# EAGLE design MotorController V2 (EAGLE 9.2.0)
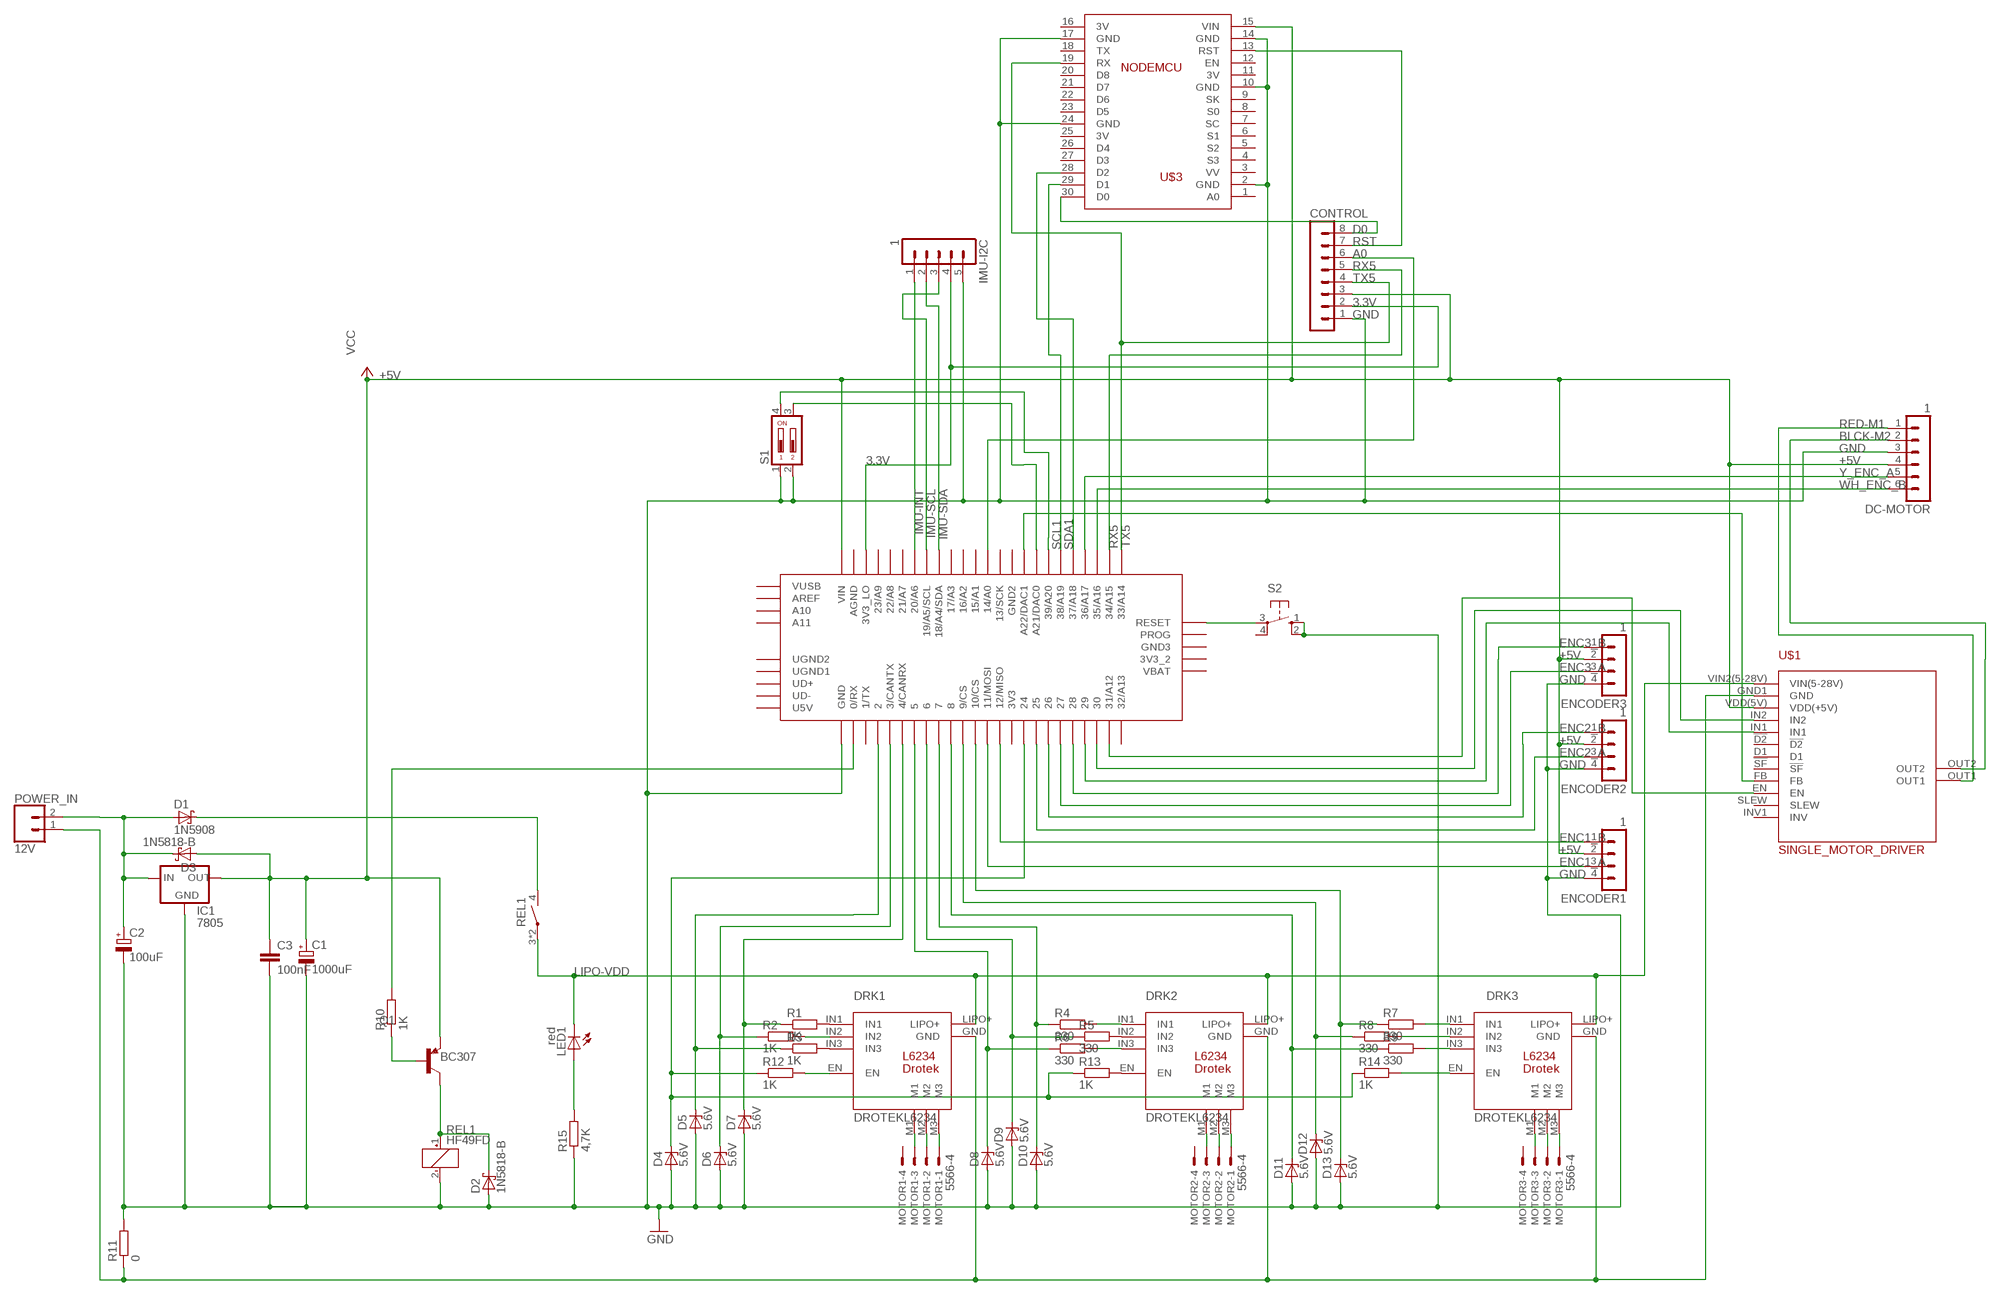
[diagram p0: schematic, sheet 1]

## Parts
C1  1000uF  CPOL-EUE2.5-6  [E2,5-6]
C2  100uF  CPOL-EUE5-5  [E5-5]
C3  100nF  C2.5/2  [C2.5-2]
CONTROL  MA08-1  [MA08-1]
D1  1N5908  [C4111-15]
D2  1N5818-B  [DO41-7.6]
D3  1N5818-B  [DO41-7.6]
D4  5.6V  ZENER-DIODEDO41Z10  [DO41Z10]
D5  5.6V  ZENER-DIODEDO41Z10  [DO41Z10]
D6  5.6V  ZENER-DIODEDO41Z10  [DO41Z10]
D7  5.6V  ZENER-DIODEDO41Z10  [DO41Z10]
D8  5.6V  ZENER-DIODEDO41Z10  [DO41Z10]
D9  5.6V  ZENER-DIODEDO41Z10  [DO41Z10]
D10  5.6V  ZENER-DIODEDO41Z10  [DO41Z10]
D11  5.6V  ZENER-DIODEDO41Z10  [DO41Z10]
D12  5.6V  ZENER-DIODEDO41Z10  [DO41Z10]
D13  5.6V  ZENER-DIODEDO41Z10  [DO41Z10]
DC-MOTOR  1  MA06-1  [MA06-1]
DRK1  DROTEKL6234  [DROTEKL6234]
DRK2  DROTEKL6234  [DROTEKL6234]
DRK3  DROTEKL6234  [DROTEKL6234]
ENCODER1  1  MA04-1  [MA04-1]
ENCODER2  1  MA04-1  [MA04-1]
ENCODER3  1  MA04-1  [MA04-1]
IC1  7805  78XXS  [78XXS]
IMU-I2C  1  MA05-1  [MA05-1]
LED1  red  LED3MM  [LED3MM]
MOTOR1  5566-4  [5566-4]
MOTOR2  5566-4  [5566-4]
MOTOR3  5566-4  [5566-4]
POWER_IN  12V  CONN_023.5MM  [SCREWTERMINAL-3.5MM-2]
PRJ1  TEENSY_3.5/3.6  [TEENSY_3.5/3.6]
Q1  BC307  [TO92]
R1  1K  R-EU_0204/7  [0204/7]
R2  1K  R-EU_0204/7  [0204/7]
R3  1K  R-EU_0204/7  [0204/7]
R4  330  R-EU_0204/7  [0204/7]
R5  330  R-EU_0204/7  [0204/7]
R6  330  R-EU_0204/7  [0204/7]
R7  330  R-EU_0204/7  [0204/7]
R8  330  R-EU_0204/7  [0204/7]
R9  330  R-EU_0204/7  [0204/7]
R10  1K  R-EU_0204/7  [0204/7]
R11  0  R-EU_0204/2V  [0204V]
R12  1K  R-EU_0204/7  [0204/7]
R13  1K  R-EU_0204/7  [0204/7]
R14  1K  R-EU_0204/7  [0204/7]
R15  4,7K  R-EU_0204/7  [0204/7]
REL1  HF49FD  [HF49FD]
S1  DIP02YL  [DIP02YL]
S2  10-XX  [B3F-10XX]
U$1  SINGLE_MOTOR_DRIVER  [MOTOR_DRIVER_MC33926_FOOTPRINT_]
U$3  NODEMCU  [NODEMCU]

## Nets
3.3V: CONTROL.2 IMU-I2C.4 PRJ1.3V3_LO
+5V: C1.+ C3.1 CONTROL.3 D3.A DC-MOTOR.4 ENCODER1.2 ENCODER2.2 ENCODER3.2 IC1.OUT PRJ1.VIN Q1.1(E) U$1.VDD(5V)(VDD(+5V)) U$3.15(VIN) ; supply symbol labelled VCC
A0: CONTROL.6 PRJ1.14/A0
BLCK-M2 [Powerline]: DC-MOTOR.2 U$1.OUT2
D0: CONTROL.8 U$3.30(D0)
ENC1_A: ENCODER1.3 PRJ1.11/MOSI
ENC1_B: ENCODER1.1 PRJ1.12/MISO
ENC2_A: ENCODER2.3 PRJ1.25
ENC2_B: ENCODER2.1 PRJ1.26
ENC3_A: ENCODER3.3 PRJ1.27
ENC3_B: ENCODER3.1 PRJ1.28
GND: C1.- C2.- C3.2 CONTROL.1 D2.A D4.A D5.A D6.A D7.A D8.A D9.A D10.A D11.A D12.A D13.A DC-MOTOR.3 ENCODER1.4 ENCODER2.4 ENCODER3.4 IC1.GND IMU-I2C.5 PRJ1.GND R11.2 R15.1 REL1.2(-) S1.1 S1.2 S2.1(S) S2.2(S1) U$3.2(GND) U$3.10(GND) U$3.14(GND) U$3.17(GND) U$3.24(GND)
IMU-INT: IMU-I2C.1 PRJ1.20/A6
IMU-SCL: IMU-I2C.3 PRJ1.19/A5/SCL
IMU-SDA: IMU-I2C.2 PRJ1.18/A4/SDA
LIPO-GND [Powerline]: DRK1.GND DRK2.GND DRK3.GND POWER_IN.1 R11.1 U$1.GND1(GND)
LIPO-VDD [Powerline]: DRK1.LIPO+ DRK2.LIPO+ DRK3.LIPO+ LED1.K(C) REL1.3(P) REL1.5(P) U$1.VIN2(5-28V)(VIN(5-28V))
N$1 [Powerline]: DRK1.M1 MOTOR1.3
N$2 [Powerline]: DRK1.M2 MOTOR1.2
N$3 [Powerline]: DRK1.M3 MOTOR1.1
N$4: DRK1.IN1 R1.2
N$5: DRK1.IN2 R2.2
N$6: DRK1.IN3 R3.2
N$7: D7.C PRJ1.4/CANRX R1.1
N$8: D6.C PRJ1.3/CANTX R2.1
N$9: D5.C PRJ1.2 R3.1
N$10: DRK3.EN R14.2
N$11: DRK2.IN1 R4.2
N$12: PRJ1.21/DAC0(A21/DAC0) S1.3
N$13 [Powerline]: DRK2.M1 MOTOR2.3
N$14 [Powerline]: DRK2.M2 MOTOR2.2
N$15 [Powerline]: DRK2.M3 MOTOR2.1
N$16 [Powerline]: DRK3.M1 MOTOR3.3
N$17 [Powerline]: DRK3.M2 MOTOR3.2
N$18 [Powerline]: DRK3.M3 MOTOR3.1
N$19: DRK2.IN2 R5.2
N$20: DRK2.IN3 R6.2
N$21: D8.C PRJ1.5 R6.1
N$22: D9.C PRJ1.6 R5.1
N$23: D10.C PRJ1.7 R4.1
N$24: DRK3.IN2 R8.2
N$25: DRK3.IN1 R7.2
N$26: DRK3.IN3 R9.2
N$27: D11.C PRJ1.8 R9.1
N$28: D12.C PRJ1.9/CS R8.1
N$29: D13.C PRJ1.10/CS R7.1
N$30: Q1.2(B) R10.1
N$31: D2.C Q1.3(C) REL1.1(+)
N$32 [Powerline]: C2.+ D1.A D3.C IC1.IN POWER_IN.2
N$39 [Powerline]: D1.C REL1.4(S)
N$40: PRJ1.39/A20 S1.4
N$41: LED1.A R15.2
N$42: PRJ1.0/RX R10.2
N$43: DRK1.EN R12.2
N$44: PRJ1.29 U$1.IN1
N$45: PRJ1.31/A12 U$1.EN
N$46: D4.C PRJ1.24 R12.1 R13.1 R14.1
N$47: PRJ1.30 U$1.IN2
N$48: DRK2.EN R13.2
N$52: PRJ1.RESET S2.3(P)
N$60: PRJ1.A22/DAC1 U$1.FB
RED-M1 [Powerline]: DC-MOTOR.1 U$1.OUT1
RST: CONTROL.7 U$3.13(RST)
RX5: CONTROL.5 PRJ1.34/A15
SCL1: PRJ1.38/A19 U$3.29(D1)
SDA1: PRJ1.37/A18 U$3.28(D2)
TX5: CONTROL.4 PRJ1.33/A14 U$3.19(RX)
WH_ENC_B: DC-MOTOR.6 PRJ1.35/A16
Y_ENC_A: DC-MOTOR.5 PRJ1.36/A17
Unconnected: MOTOR1.4 MOTOR2.4 MOTOR3.4 PRJ1.1/TX PRJ1.3V3 PRJ1.3V3_2 PRJ1.13/SCK PRJ1.15/A1 PRJ1.16/A2 PRJ1.17/A3 PRJ1.21/A7 PRJ1.22/A8 PRJ1.23/A9 PRJ1.32/A13 PRJ1.A10 PRJ1.A11 PRJ1.AGND PRJ1.AREF PRJ1.GND2 PRJ1.GND3 PRJ1.PROG PRJ1.U5V PRJ1.UD+ PRJ1.UD- PRJ1.UGND1 PRJ1.UGND2 PRJ1.VBAT PRJ1.VUSB S2.4(P1) U$1.!D2 U$1.!SF U$1.D1 U$1.INV1(INV) U$1.SLEW U$3.1(A0) U$3.3(VV) U$3.4(S3) U$3.5(S2) U$3.6(S1) U$3.7(SC) U$3.8(S0) U$3.9(SK) U$3.12(EN) U$3.18(TX) U$3.20(D8) U$3.21(D7) U$3.22(D6) U$3.23(D5) U$3.26(D4) U$3.27(D3)

## Power pins joined to a net without a drawn wire
3V: U$3.11(3V) U$3.16(3V) U$3.25(3V)

## Library data of the parts
C1 C2 = rcl:CPOL-EU: POLARIZED CAPACITOR, European symbol; SPICEPREFIX: C
C3 = capacitor-wima:C: CAPACITOR naming: grid - package width
CONTROL = con-lstb:MA08-1: PIN HEADER; OC_FARNELL: unknown; OC_NEWARK: unknown
D1 = diode:1N5908: DIODE schottky
D2 D3 = diode:1N581*: 1.0A SCHOTTKY BARRIER RECTIFIER Source: http://www.diodes.com/datasheets/ds23001.pdf
D4-D13 = diode:ZENER-DIODE: Z-Diode
DC-MOTOR = con-lstb:MA06-1: PIN HEADER; OC_FARNELL: unknown; OC_NEWARK: unknown
DRK1-DRK3 = Drotek L6234:DROTEKL6234
ENCODER1-ENCODER3 = con-lstb:MA04-1: PIN HEADER; OC_FARNELL: unknown; OC_NEWARK: unknown
IC1 = v-reg:78XXS: VOLTAGE REGULATOR
IMU-I2C = con-lstb:MA05-1: PIN HEADER; OC_FARNELL: unknown; OC_NEWARK: unknown
LED1 = led:LED: LED OSRAM: - CHIPLED LG R971, LG N971, LY N971, LG Q971, LY Q971, LO R971, LY R971 LH N974, LH R974 LS Q976, LO Q976, LY Q976 LO Q996 - Hyper CHIPLED LW Q18S LB Q993, LB Q99A, LB R99A - SideLED LS A670, LO A670, LY A670, LG A670, LP A670 LB A673, LV A673, LT A673, LW A673 LH A674 LY A675 LS A676, LA A676, LO A676, LY A676, LW A676 LS A679, LY A679, LG A679 - Hyper Micro SIDELED® LS Y876, LA Y876, LO Y876, LY Y876 LT Y87S - SmartLED LW L88C, LW L88S LB L89C, LB L89S, LG L890 LS L89K, LO L89K, LY L89K LS L896, LA L896, LO L896, LY L896 - TOPLED LS T670, LO T670, LY T670, LG T670, LP T670 LSG T670, LSP T670, LSY T670, LOP T670, LYG T670 LG T671, LOG T671, LSG T671 LB T673, LV T673, LT T673, LW T673 LH T674 LS T676, LA T676, LO T676, LY T676, LB T676, LH T676, LSB T676, LW T676 LB T67C, LV T67C, LT T67C, LS T67K, LO T67K, LY T67K, LW E67C LS E67B, LA E67B, LO E67B, LY E67B, LB E67C, LV E67C, LT E67C LW T67C LS T679, LY T679, LG T679 LS T770, LO T770, LY T770, LG T770, LP T770 LB T773, LV T773, LT T773, LW T773 LH T774 LS E675, LA E675, LY E675, LS T675 LS T776, LA T776, LO T776, LY T776, LB T776 LHGB T686 LT T68C, LB T68C - Hyper Mini TOPLED® LB M676 - Mini TOPLED Santana® LG M470 LS M47K, LO M47K, LY M47K Source: http://www.osram.convergy.de LUXEON: - LUMILED® LXK2-PW12-R00, LXK2-PW12-S00, LXK2-PW14-U00, LXK2-PW14-V00 LXK2-PM12-R00, LXK2-PM12-S00, LXK2-PM14-U00 LXK2-PE12-Q00, LXK2-PE12-R00, LXK2-PE12-S00, LXK2-PE14-T00, LXK2-PE14-U00 LXK2-PB12-K00, LXK2-PB12-L00, LXK2-PB12-M00, LXK2-PB14-N00, LXK2-PB14-P00, LXK2-PB14-Q00 LXK2-PR12-L00, LXK2-PR12-M00, LXK2-PR14-Q00, LXK2-PR14-R00 LXK2-PD12-Q00, LXK2-PD12-R00, LXK2-PD12-S00 LXK2-PH12-R00, LXK2-PH12-S00 LXK2-PL12-P00, LXK2-PL12-Q00, LXK2-PL12-R00 Source: www.luxeon.com KINGBRIGHT: KA-3528ASYC Source: www.kingbright.com
MOTOR1-MOTOR3 = con-molex:5566-4: Mini FIT connector 4 pol Source: http://www.molex.com; MF: MOLEX; OC_FARNELL: unknown; OC_NEWARK: unknown
POWER_IN = SparkFun-Connectors:CONN_02: Multi connection point. Often used as Generic Header-pin footprint for 0.1 inch spaced/style header connections On any of the 0.1 inch spaced packages, you can populate with these: Break Away Headers - Straight <https://www.sparkfun.com/products/116> (PRT-00116) Break Away Male Headers - Right Angle <https://www.sparkfun.com/products/553> (PRT-00553) Female Headers <https://www.sparkfun.com/products/115> (PRT-00115) Break Away Headers - Machine Pin <https://www.sparkfun.com/products/117> (PRT-00117) Break Away Female Headers - Swiss Machine Pin <https://www.sparkfun.com/products/743> (PRT-00743) For SCREWTERMINALS and SPRING TERMINALS visit here: Screw Terimnals on SparkFun.com <https://www.sparkfun.com/search/results?term=Screw+Terminals> (5mm/3.5mm/2.54mm spacing) This device is also useful as a general connection point to wire up your design to another part of your project. Our various solder wires solder well into these plated through hole pads. Hook-Up Wire - Assortment (Stranded, 22 AWG) <https://www.sparkfun.com/products/11375> (PRT-11375) Hook-Up Wire - Assortment (Solid Core, 22 AWG) <https://www.sparkfun.com/products/11367> (PRT-11367) View the entire wire category on our website here <https://www.sparkfun.com/categories/141> Special notes: Molex polarized connector foot print use with: PRT-08233 with associated crimp pins and housings. 2.54_SCREWTERM for use with PRT-10571. 3.5mm Screw Terminal footprints for PRT-08084 5mm Screw Terminal footprints for use with PRT-08432; PROD_ID: CONN-08399
PRJ1 = Teensy356:TEENSY_3.5/3.6
Q1 = transistor-pnp:BC307: PNP Transistor
R1-R15 = resistor:R-EU_: RESISTOR, European symbol
REL1 = relay:HF49FD
S1 = switch-dil:DIP02YL: DIL/CODE SWITCH; OC_FARNELL: unknown; OC_NEWARK: unknown
S2 = switch-omron:10-XX: OMRON SWITCH; MPN: B3F-1000; OC_FARNELL: 176432; OC_NEWARK: 36M3542
U$1 = pololu motor driver:SINGLE_MOTOR_DRIVER: Single Motor Driver (MC33926)
U$3 = nodemcu:NODEMCU

## Net classes
0 default: width 0.254 mm, drill 0.635 mm, clearance 0.635 mm
1 Powerline: width 1 mm, drill 0.635 mm, clearance 0.635 mm

## Board
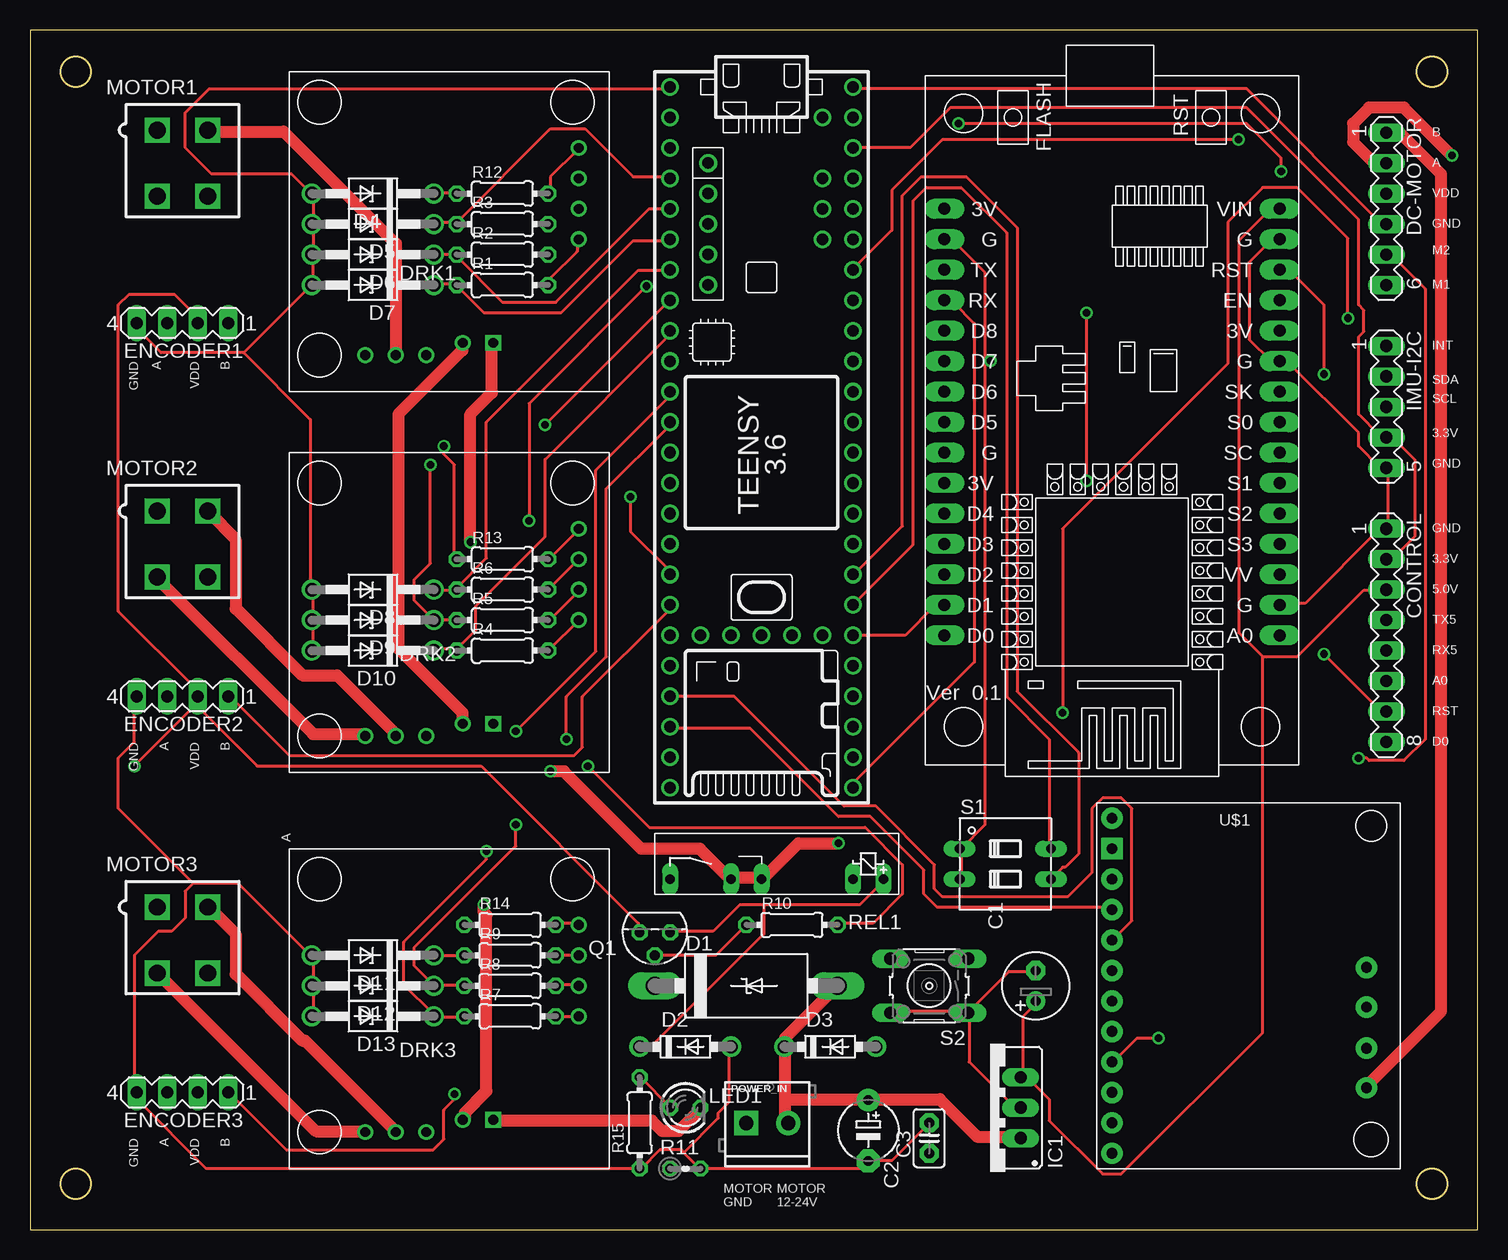
[diagram p1: board, top side]
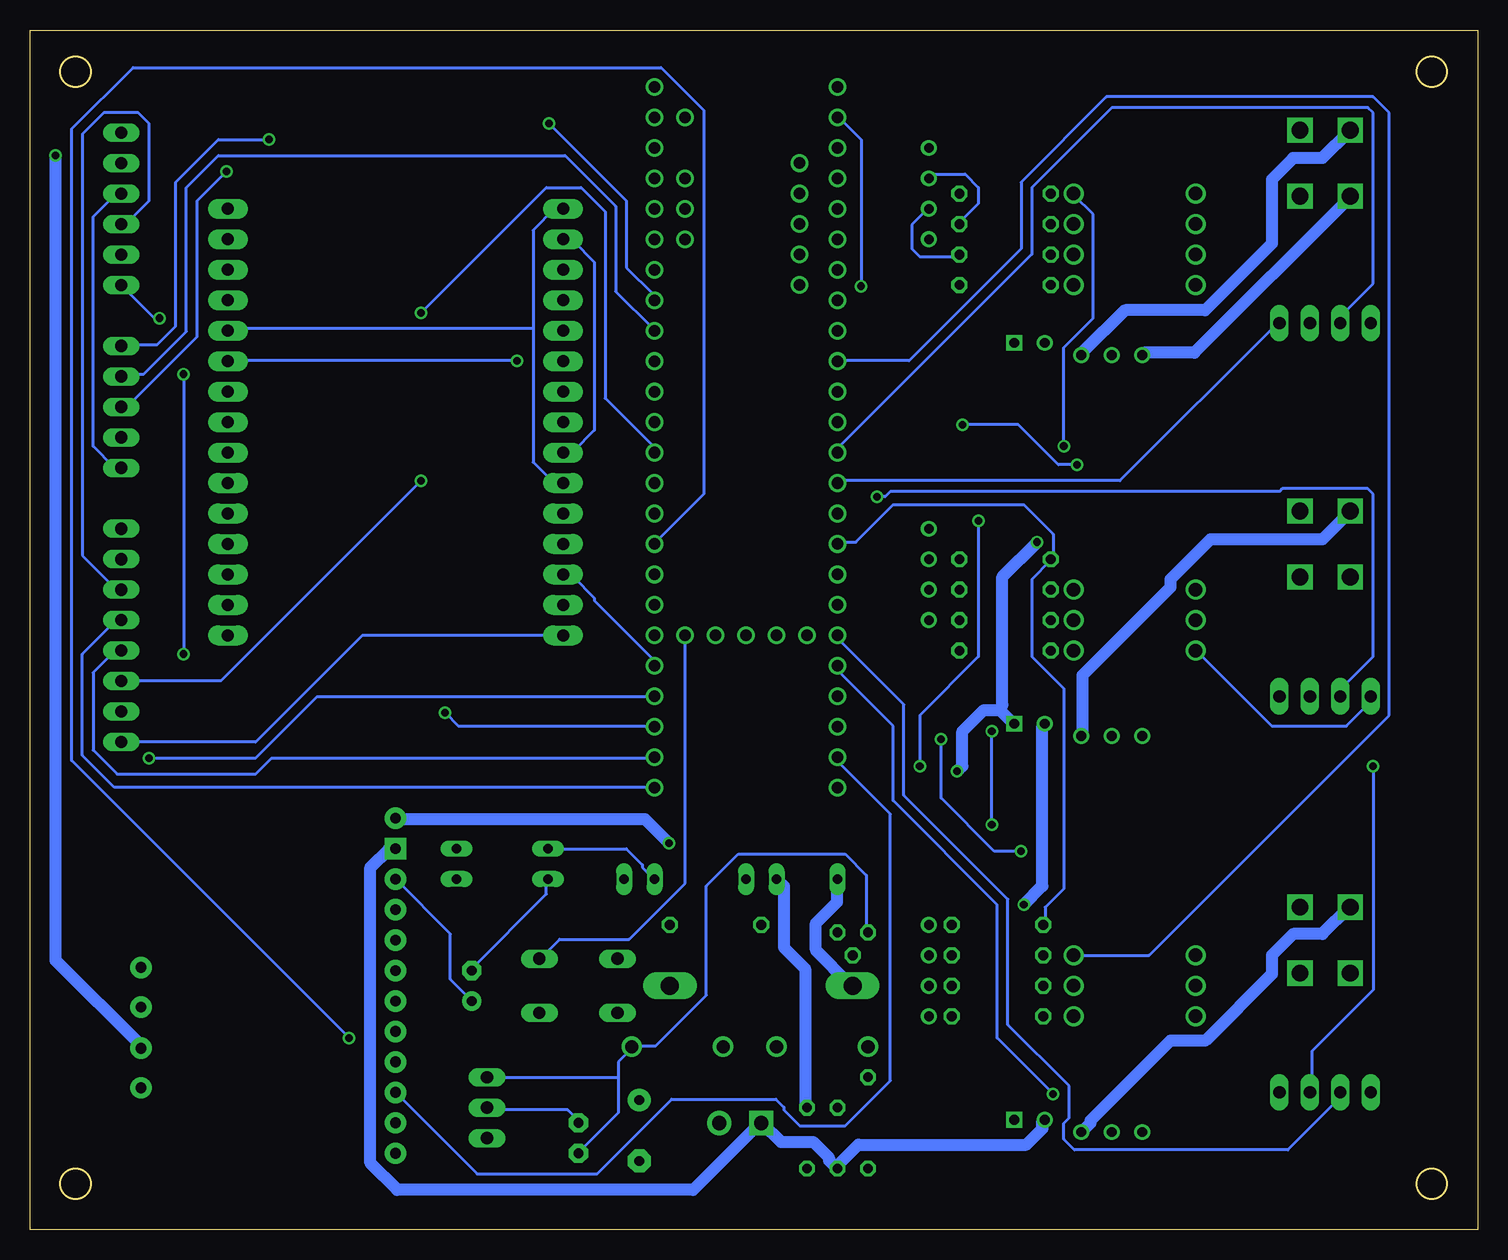
[diagram p2: board, bottom side, seen from below]

Size 120.63 x 100 mm. Coordinates in mm from the lower left corner, seen from the top.
Outline: 0,0 120.63,0 120.63,100 0,100 0,0
Outline: circle at 116.84,96.52 radius 1.27
Outline: circle at 3.81,96.52 radius 1.27
Outline: circle at 3.81,3.81 radius 1.27
Outline: circle at 116.84,3.81 radius 1.27
Copper layers (1*16): Top 0.035mm / dielectric 1.5mm / Bottom 0.035mm
Design rules "default *": minimum track width 6mil, minimum drill 0.35mm, track to track 6mil, track to pad 6mil, pad to pad 6mil, via to via 6mil, smd to smd 6mil, copper to edge 30mil, drill to drill 6mil, minimum pad ring 10mil, minimum via ring 8mil, stop-mask expansion 4mil, vias tented up to drill 0mil, thermal gap 10mil

### Footprints (pad centres in the part's own frame; a part is rotated, then mirrored left to right if it is on the bottom)
E2,5-6 = drill 0.813 pad 1.6: + -1.27,0 | drill 0.813 pad 1.6 octagon: - 1.27,0
E5-5 = drill 0.813 pad 1.905: + -2.54,0 | drill 0.813 pad 1.905 octagon: - 2.54,0
C2.5-2 = drill 0.813 pad 1.6 octagon: 1 -1.27,0; 2 1.27,0
MA08-1 = drill 1.016 long: 1 -8.89,0; 2 -6.35,0; 3 -3.81,0; 4 -1.27,0; 5 1.27,0; 6 3.81,0; 7 6.35,0; 8 8.89,0
C4111-15 = drill 1.499 long: A 7.62,0; C -7.62,0
DO41-7.6 = drill 1.1 pad 1.7: A 3.81,0; C -3.81,0
DO41Z10 = drill 1.118: A 5.08,0; C -5.08,0
MA06-1 = drill 1.016 long: 1 -6.35,0; 2 -3.81,0; 3 -1.27,0; 4 1.27,0; 5 3.81,0; 6 6.35,0
DROTEKL6234 = drill 0.813 pad 1.27: EN -11.43,-6.35; GND -1.778,9.906; IN1 -11.43,1.27; IN2 -11.43,-1.27; IN3 -11.43,-3.81; M1 6.35,10.922; M2 3.81,10.922; M3 1.27,10.922 | drill 0.813 square: LIPO+ -4.318,9.906
MA04-1 = drill 1.016 long: 1 -3.81,0; 2 -1.27,0; 3 1.27,0; 4 3.81,0
78XXS = drill 1.016 long: GND 0,-2.54; IN -2.54,-2.54; OUT 2.54,-2.54
MA05-1 = drill 1.016 long: 1 -5.08,0; 2 -2.54,0; 3 0,0; 4 2.54,0; 5 5.08,0
LED3MM = drill 0.813 octagon: A -1.27,0; K 1.27,0
5566-4 = drill 1.4 square: 1 2.1,-2.75; 2 -2.1,-2.75; 3 2.1,2.75; 4 -2.1,2.75
SCREWTERMINAL-3.5MM-2 = drill 1.2 pad 2.032 square: 1 0,0 | drill 1.2 pad 2.032: 2 3.5,0
TEENSY_3.5/3.6 = drill 0.965: 0/RX -25.4,-7.62; 1/TX -22.86,-7.62; 2 -20.32,-7.62; 3/CANTX -17.78,-7.62; 3V3 7.62,-7.62; 3V3_2 17.78,-2.54; 3V3_LO -22.86,7.62; 4/CANRX -15.24,-7.62; 5 -12.7,-7.62; 6 -10.16,-7.62; 7 -7.62,-7.62; 8 -5.08,-7.62; 9/CS -2.54,-7.62; 10/CS 0,-7.62; 11/MOSI 2.54,-7.62; 12/MISO 5.08,-7.62; 13/SCK 5.08,7.62; 14/A0 2.54,7.62; 15/A1 0,7.62; 16/A2 -2.54,7.62; 17/A3 -5.08,7.62; 18/A4/SDA -7.62,7.62; 19/A5/SCL -10.16,7.62; 20/A6 -12.7,7.62; 21/A7 -15.24,7.62; 21/DAC0 12.7,7.62; 22/A8 -17.78,7.62; 23/A9 -20.32,7.62; 24 10.16,-7.62; 25 12.7,-7.62; 26 15.24,-7.62; 27 17.78,-7.62; 28 20.32,-7.62; 29 22.86,-7.62; 30 25.4,-7.62; 31/A12 27.94,-7.62; 32/A13 30.48,-7.62; 33/A14 30.48,7.62; 34/A15 27.94,7.62; 35/A16 25.4,7.62; 36/A17 22.86,7.62; 37/A18 20.32,7.62; 38/A19 17.78,7.62; 39/A20 15.24,7.62; A10 -17.78,5.08; A11 -15.24,5.08; A22/DAC1 10.16,7.62; AGND -25.4,7.62; AREF -20.32,5.08; GND -27.94,-7.62; GND2 7.62,7.62; GND3 17.78,0; PROG 17.78,2.54; RESET 17.78,5.08; U5V -21.59,-4.445; UD+ -16.51,-4.445; UD- -19.05,-4.445; UGND1 -13.97,-4.445; UGND2 -11.43,-4.445; VBAT 17.78,-5.08; VIN -27.94,7.62; VUSB -25.4,5.08
TO92 = drill 0.813 octagon: 1 1.27,0; 2 0,1.905; 3 -1.27,0
0204/7 = drill 0.813 octagon: 1 -3.81,0; 2 3.81,0
0204V = drill 0.813 octagon: 1 -1.27,0; 2 1.27,0
HF49FD = drill 0.813 long: 1 -7.62,0; 2 -5.08,0; 3 2.54,0; 4 10.16,0; 5 5.08,0
DIP02YL = drill 0.813 long: 1 -1.27,-3.81; 2 1.27,-3.81; 3 1.27,3.81; 4 -1.27,3.81
B3F-10XX = drill 1.016 long: 1 -3.251,2.261; 2 3.251,2.261; 3 -3.251,-2.261; 4 3.251,-2.261
MOTOR_DRIVER_MC33926_FOOTPRINT_ = drill 0.9 pad 1.778: !D2 -3.81,0; !SF -3.81,-5.08; D1 -3.81,-2.54; EN -3.81,-10.16; FB -3.81,-7.62; GND 17.399,-3.048; IN1 -3.81,2.54; IN2 -3.81,5.08; INV1 -3.81,-15.24; OUT1 17.399,-9.779; OUT2 17.399,-6.477; SLEW -3.81,-12.7; VDD(5V) -3.81,7.62; VIN2(5-28V) -3.81,12.7; VIN(5-28V) 17.399,0.254 | drill 0.9 pad 1.778 square: GND1 -3.81,10.16
NODEMCU = drill 1 pad 1.676 long: 1 -13.97,17.78; 2 -13.97,15.24; 3 -13.97,12.7; 4 -13.97,10.16; 5 -13.97,7.62; 6 -13.97,5.08; 7 -13.97,2.54; 8 -13.97,0; 9 -13.97,-2.54; 10 -13.97,-5.08; 11 -13.97,-7.62; 12 -13.97,-10.16; 13 -13.97,-12.7; 14 -13.97,-15.24; 15 -13.97,-17.78; 16 13.97,-17.78; 17 13.97,-15.24; 18 13.97,-12.7; 19 13.97,-10.16; 20 13.97,-7.62; 21 13.97,-5.08; 22 13.97,-2.54; 23 13.97,0; 24 13.97,2.54; 25 13.97,5.08; 26 13.97,7.62; 27 13.97,10.16; 28 13.97,12.7; 29 13.97,15.24; 30 13.97,17.78

### Placement (x,y rotation side)
C1  83.82,20.32 90 top
C2  69.85,8.26 270 top
C3  74.93,7.62 90 top
CONTROL  113.03,49.53 270 top
D1  59.69,20.32 0 top
D2  54.61,15.24 0 top
D3  66.68,15.24 0 top
D4  28.58,86.36 180 top
D5  28.58,83.82 180 top
D6  28.58,81.28 180 top
D7  28.58,78.74 180 top
D8  28.58,53.34 180 top
D9  28.58,50.8 180 top
D10  28.58,48.26 180 top
D11  28.58,22.86 180 top
D12  28.58,20.32 180 top
D13  28.58,17.78 180 top
DC-MOTOR  113.03,85.09 270 top
DRK1  34.29,83.82 180 top
DRK2  34.29,52.07 180 top
DRK3  34.29,19.05 180 top
ENCODER1  12.7,75.56 180 top
ENCODER2  12.7,44.45 180 top
ENCODER3  12.7,11.43 180 top
IC1  80.01,10.16 90 top
IMU-I2C  113.03,68.58 270 top
LED1  54.61,10.16 0 top
MOTOR1  12.7,88.9 180 top
MOTOR2  12.7,57.15 180 top
MOTOR3  12.7,24.13 180 top
POWER_IN  59.69,8.89 0 top
PRJ1  60.96,67.31 270 top
Q1  52.07,24.77 180 top
R1  39.37,78.74 0 top
R2  39.37,81.28 0 top
R3  39.37,83.82 0 top
R4  39.37,48.26 0 top
R5  39.37,50.8 0 top
R6  39.37,53.34 0 top
R7  40.01,17.78 0 top
R8  40.01,20.32 0 top
R9  40.01,22.86 0 top
R10  63.5,25.4 0 top
R11  54.61,5.08 0 top
R12  39.37,86.36 0 top
R13  39.37,55.88 0 top
R14  40.01,25.4 0 top
R15  50.8,8.89 90 top
REL1  63.5,29.21 180 top
S1  81.28,30.48 270 top
S2  74.93,20.32 180 top
U$1  93.98,21.59 0 top
U$3  90.17,67.31 180 top

### Tracks (layer width: path | path; a pad name or v marks a point on that pad's centre or on a via)
3.3V
  Top 0.254: PRJ1.3V3_LO 68.71,90.2 73.37,90.2 76.71,93.54 101.38,93.54 110.71,84.2 110.71,77.09 111.16,76.64 111.16,74.87 110.71,74.42 110.71,67.98 112.49,66.2 112.94,66.2 IMU-I2C.4 113.16,65.98 113.6,65.98 115.38,64.2 115.38,57.75 113.6,55.98 113.16,55.98 CONTROL.2
3V
  Bottom 0.254: 78.71,75.09 78.71,83.31 76.93,85.09 U$3.16 | 78.71,75.09 78.71,63.98 77.15,62.42 76.26,62.42 U$3.25 | 78.71,75.09 104.05,75.09 U$3.11
+5V  (via drill 0.64)
  Top 0.254: 102.71,47.75 105.6,47.75 111.16,53.31 112.94,53.31 CONTROL.3 | 102.71,47.75 100.71,49.75 100.71,82.42 103.38,85.09 U$3.15 | PRJ1.VIN 68.71,95.09 101.38,95.09 112.49,83.98 112.94,83.98 DC-MOTOR.4 | 82.71,13.08 82.71,17.75 83.82,18.86 C1.+ | 82.71,13.08 82.71,12.86 IC1.OUT 82.71,13.08 | 13.81,43.75 v8.7,38.64 | 13.81,43.75 13.81,44.42 ENCODER2.2 | ENCODER1.2 13.81,75.75 13.81,76.2 12.03,77.98 8.26,77.98 7.37,77.09 7.37,51.53 13.81,45.09 13.81,44.64 ENCODER2.2 | 13.81,43.75 18.92,38.64 37.59,38.64 50.71,25.53 50.71,24.86 Q1.1 | 13.81,43.75 ENCODER2.2 | 102.71,47.75 102.71,16.41 90.93,4.63 89.38,4.63 84.93,9.08 84.93,10.86 82.71,13.08
  Bottom 0.254: CONTROL.3 113.16,53.53 113.6,53.53 116.27,56.2 116.27,91.31 114.49,93.09 111.6,93.09 110.71,92.2 110.71,85.76 112.49,83.98 112.94,83.98 DC-MOTOR.4 | U$1.VDD(5V) 85.6,24.64 85.6,20.86 83.82,19.08 C1.+ | Q1.1 50.93,24.86 50.93,29.53 52.71,31.3 61.6,31.3 64.26,28.64 64.26,19.53 68.49,15.3 70.49,15.3 D3.A 70.49,15.08 71.6,13.97 71.6,12.64 | 71.6,12.64 71.6,9.75 74.93,6.41 C3.1 | 71.6,12.64 82.49,12.64 IC1.OUT | v8.7,38.64 8.7,19.97 13.81,14.86 13.81,11.53 ENCODER3.2
A0  (via drill 0.64)
  Top 0.254: v88.04,62.42 v88.04,76.42
  Bottom 0.254: v88.04,76.42 77.6,86.87 74.71,86.87 72.71,84.87 72.71,69.31 68.71,65.31 68.71,64.87 PRJ1.14/A0 | v88.04,62.42 104.71,45.75 112.94,45.75 CONTROL.6
BLCK-M2  (via drill 0.64)
  Top 1: v118.49,89.53 114.49,93.54 111.6,93.54 110.27,92.2 110.27,90.65 111.82,89.09 112.94,89.09 DC-MOTOR.2
  Bottom 1: v118.49,89.53 118.49,22.41 111.38,15.3 U$1.OUT2
D0
  Bottom 0.254: CONTROL.8 101.82,40.64 92.93,49.53 U$3.30
ENC1_A
  Bottom 0.254: PRJ1.11/MOSI 53.15,64.87 53.15,65.31 37.15,81.31 37.15,86.87 30.48,93.54 9.14,93.54 8.7,93.09 8.7,78.87 11.37,76.2 11.37,75.75 ENCODER1.3
ENC1_B
  Bottom 0.254: PRJ1.12/MISO 53.15,62.42 29.81,62.42 16.7,75.53 ENCODER1.1
ENC2_A  (via drill 0.64)
  Top 0.254: v50.04,61.09 50.04,58.2 53.15,55.09 53.15,54.64 PRJ1.25
  Bottom 0.254: v50.04,61.09 49.37,61.09 48.93,61.53 16.48,61.53 16.26,61.75 9.14,61.75 8.7,61.31 8.7,47.75 11.37,45.09 11.37,44.64 ENCODER2.3
ENC2_B
  Top 0.254: PRJ1.26 53.15,51.98 53.15,51.53 46.04,44.42 46.04,40.2 45.37,39.53 21.59,39.53 16.7,44.42 ENCODER2.1
ENC3_A
  Bottom 0.254: PRJ1.27 53.15,49.53 53.15,49.09 47.82,43.75 47.82,36.2 39.15,27.53 39.15,17.08 34.04,11.97 34.04,9.3 34.48,8.86 34.48,7.53 33.59,6.64 15.81,6.64 11.59,10.86 11.59,11.3 ENCODER3.3
ENC3_B  (via drill 0.64)
  Top 0.254: v35.37,11.3 35.37,10.86 34.48,9.97 34.48,7.53 33.59,6.64 21.37,6.64 16.7,11.3 ENCODER3.1
  Bottom 0.254: v35.37,11.3 40.04,15.97 40.04,27.08 48.7,35.75 48.7,41.97 53.15,46.42 53.15,46.86 PRJ1.28
GND  (via drill 0.64)
  Top 0.254: D10.A 23.59,48.42 23.59,50.64 D9.A 23.59,50.86 23.59,53.31 D8.A 23.37,53.53 23.37,67.53 17.81,73.09 | D13.A 23.59,17.97 23.59,20.19 D12.A 23.59,20.41 23.59,22.86 D11.A 23.37,22.86 17.37,28.86 13.59,28.86 | 13.59,28.86 12.92,28.19 12.92,25.97 11.81,24.86 10.7,24.86 8.7,22.86 8.7,11.53 ENCODER3.4 8.92,11.3 8.92,10.86 14.7,5.08 R15.1 50.93,5.08 52.48,6.64 54.26,6.64 54.48,6.41 | 13.59,28.86 7.37,35.08 7.37,39.31 8.7,40.64 8.7,44.42 ENCODER2.4 | 17.81,73.09 10.92,73.09 8.92,75.09 8.92,75.53 ENCODER1.4 | 17.81,73.09 23.37,78.64 D7.A 23.59,78.87 23.59,81.09 D6.A 23.59,81.31 23.59,83.76 D5.A 23.59,83.98 23.59,86.2 D4.A 23.37,86.42 21.81,87.98 15.15,87.98 12.92,90.2 12.92,93.09 14.92,95.09 53.15,95.09 PRJ1.GND | U$3.14 104.05,82.42 103.38,82.42 101.6,80.64 101.6,74.2 103.38,72.42 104.05,72.42 U$3.10 104.27,72.2 104.93,72.2 110.71,66.42 110.71,65.31 112.49,63.53 112.94,63.53 IMU-I2C.5 113.16,63.31 113.16,58.42 CONTROL.1 112.49,58.42 106.27,52.2 104.27,52.2 U$3.2 | 54.48,6.41 55.82,5.08 R11.2 69.37,5.08 69.82,5.53 C2.- 70.04,5.75 71.82,5.75 74.93,8.86 C3.2 | 54.48,6.41 57.37,9.3 57.37,9.75 58.26,10.64 58.26,15.08 D2.A | 77.6,31.75 77.6,29.3 S1.2 | S2.2 71.82,18.19 78.04,18.19 S2.1 | C1.- 83.82,21.53 81.6,21.53 78.26,18.19 S2.1 | 79.6,72.42 79.6,33.75 77.6,31.75 | 79.6,72.42 79.6,79.76 76.93,82.42 76.26,82.42 U$3.17 | 77.6,31.75 S1.1 | IC1.GND 82.49,10.19 82.04,10.19 78.26,13.97 78.26,17.97 S2.1 | 79.6,72.42 v80.04,72.42
  Bottom 0.254: ENCODER2.4 8.92,44.42 8.92,43.97 10.92,41.97 17.15,41.97 23.37,48.2 D10.A | DC-MOTOR.3 113.16,86.2 113.6,86.2 115.38,84.42 115.38,65.31 113.6,63.53 113.16,63.53 IMU-I2C.5 | IC1.GND 82.49,9.97 75.82,9.97 74.93,9.08 C3.2 | U$3.24 76.04,64.87 75.38,64.87 73.6,66.64 73.6,80.64 75.38,82.42 76.04,82.42 U$3.17 | S1.1 70.93,31.75 69.6,30.42 69.6,30.19 68.71,29.3 REL1.2 | S1.2 77.6,29.08 77.6,27.97 83.82,21.75 C1.- | v80.04,72.42 104.05,72.42 U$3.10
IMU-INT  (via drill 0.64)
  Top 0.254: v100.71,90.87 76.04,90.87 71.82,86.65 71.82,83.31 68.71,80.2 PRJ1.20/A6
  Bottom 0.254: v100.71,90.87 104.93,90.87 108.49,87.31 108.49,75.31 110.05,73.75 112.94,73.75 IMU-I2C.1
IMU-SCL  (via drill 0.64)
  Top 0.254: v77.38,92.2 101.38,92.2 104.27,89.31 v104.27,88.2
  Bottom 0.254: v77.38,92.2 70.93,85.76 70.93,80.2 68.71,77.98 68.71,77.53 PRJ1.19/A5/SCL | v104.27,88.2 106.71,85.76 106.71,74.42 112.49,68.64 112.94,68.64 IMU-I2C.3
IMU-SDA
  Bottom 0.254: PRJ1.18/A4/SDA 68.71,75.09 71.82,78.2 71.82,85.31 76.04,89.53 104.93,89.53 107.6,86.87 107.6,74.87 111.16,71.31 112.94,71.31 IMU-I2C.2
LIPO-GND  (via drill 0.64)
  Top 1: DRK2.GND 36.04,42.2 36.04,43.09 30.7,48.42 30.7,67.98 36.04,73.31 36.04,73.75 DRK1.GND | v37.81,27.08 37.81,26.42 38.04,26.19 38.04,11.53 36.26,9.75 36.26,9.3 DRK3.GND
  Bottom 1: DRK3.GND 36.26,9.08 36.26,8.41 37.59,7.08 51.59,7.08 53.15,5.53 R11.1 53.37,5.08 54.04,5.75 54.04,5.97 55.37,7.3 58.04,7.3 59.6,8.86 POWER_IN.1 60.04,8.64 65.37,3.3 90.04,3.3 92.27,5.53 92.27,30.19 90.71,31.75 U$1.GND1 | v37.81,27.08 36.26,28.64 36.26,41.97 DRK2.GND
LIPO-VDD  (via drill 0.64)
  Top 1: DRK3.LIPO+ 38.7,9.08 51.82,9.08 52.71,8.19 54.04,8.19 55.82,9.97 LED1.K | v43.37,38.2 44.48,38.2 50.93,31.75 55.82,31.75 58.04,29.53 REL1.5 58.48,29.3 60.93,29.3 REL1.3 61.37,29.53 64.04,32.19 v67.37,32.19 | v36.7,57.31 36.7,67.98 38.48,69.75 38.48,73.75 DRK1.LIPO+
  Bottom 1: 39.82,43.31 38.7,42.2 DRK2.LIPO+ | 39.82,43.31 41.15,43.31 42.93,41.53 42.93,38.64 v43.37,38.2 | v36.7,57.31 39.59,54.42 39.59,43.75 39.82,43.31 | v67.37,32.19 69.37,34.2 90.04,34.2 U$1.VIN2(5-28V) | LED1.K 56.04,10.19 56.04,21.75 57.82,23.53 57.82,28.64 58.26,29.08 REL1.5
N$1
  Bottom 1: DRK1.M1 27.81,73.09 23.59,73.09 10.7,85.98 MOTOR1.3
N$2
  Top 1: DRK1.M2 30.48,82.2 21.15,91.53 14.92,91.53 MOTOR1.2
N$3
  Bottom 1: DRK1.M3 32.93,73.09 29.37,76.64 22.7,76.64 17.15,82.2 17.15,87.53 15.37,89.31 12.92,89.31 10.7,91.53 MOTOR1.1
N$4
  Top 0.254: R1.2 43.37,78.87 43.37,79.31 45.59,81.53 45.59,82.42 DRK1.IN1
N$5
  Bottom 0.254: R2.2 43.37,81.09 46.48,81.09 47.15,81.76 47.15,83.76 45.82,85.09 DRK1.IN2
N$6
  Bottom 0.254: DRK1.IN3 45.37,87.98 42.7,87.98 41.59,86.87 41.59,85.53 43.15,83.98 R3.2
N$7
  Top 0.254: D7.C 33.81,78.87 35.37,78.87 R1.1 35.59,78.64 37.81,76.42 44.26,76.42 50.26,82.42 53.15,82.42 PRJ1.4/CANRX
N$8
  Top 0.254: D6.C 33.81,81.31 35.37,81.31 R2.1 35.59,81.09 39.37,77.31 43.82,77.31 51.59,85.09 PRJ1.3/CANTX
N$9
  Top 0.254: D5.C 33.81,83.98 35.37,83.98 R3.1 35.59,83.98 43.37,91.76 46.26,91.76 50.26,87.76 53.15,87.76 PRJ1.2
N$10
  Top 0.254: R14.2 43.82,25.53 45.59,25.53 DRK3.EN
N$11
  Top 0.254: R4.2 43.37,48.42 45.59,50.64 DRK2.IN1
N$12
  Top 0.254: S1.3 85.15,29.3 86.04,30.19 86.27,30.19 87.38,31.3 87.38,39.75 82.26,44.86 82.26,83.53 78.04,87.76 74.26,87.76 72.71,86.2 72.71,58.64 68.71,54.64 PRJ1.21/DAC0
N$13
  Top 1: DRK2.M1 27.81,41.31 23.59,41.31 10.7,54.2 MOTOR2.3
N$14
  Top 1: DRK2.M2 30.48,41.31 25.59,46.2 22.7,46.2 17.15,51.75 17.15,57.53 14.92,59.75 MOTOR2.2
N$15
  Bottom 1: DRK2.M3 32.93,41.31 32.93,46.2 25.59,53.53 25.59,54.2 22.26,57.53 12.92,57.53 10.7,59.75 MOTOR2.1
N$16
  Top 1: DRK3.M1 27.81,8.19 23.81,8.19 10.7,21.3 MOTOR3.3
N$17
  Top 1: DRK3.M2 30.48,8.19 22.92,15.75 22.7,15.75 17.15,21.3 17.15,24.64 14.92,26.86 MOTOR3.2
N$18
  Bottom 1: DRK3.M3 32.93,8.19 32.26,8.86 32.26,9.08 25.59,15.75 22.7,15.75 17.15,21.3 17.15,22.86 15.37,24.64 12.92,24.64 10.7,26.86 MOTOR3.1
N$19
  Top 0.254: R5.2 43.37,50.86 45.82,53.31 DRK2.IN2
N$20
  Top 0.254: DRK2.IN3 R6.2
N$21
  Top 0.254: D8.C 33.81,53.31 35.37,53.31 R6.1 35.59,53.53 38.04,55.98 38.04,67.31 50.71,79.98 53.15,79.98 PRJ1.5
N$22  (via drill 0.64)
  Top 0.254: R5.1 35.37,50.86 33.81,50.86 D9.C 32.04,52.42 32.04,54.2 33.37,55.53 v33.37,63.75 | v42.93,67.09 53.15,77.31 PRJ1.6
  Bottom 0.254: v42.93,67.09 38.26,67.09 34.93,63.75 v33.37,63.75
N$23
  Top 0.254: D10.C 33.81,48.42 35.37,48.42 R4.1 35.59,48.42 37.15,49.98 37.15,51.98 42.93,57.75 42.93,64.2 53.15,74.42 53.15,74.87 PRJ1.7
N$24
  Top 0.254: R8.2 43.82,20.41 45.59,20.41 DRK3.IN2
N$25
  Top 0.254: R7.2 43.82,17.75 45.59,17.75 DRK3.IN1
N$26
  Top 0.254: DRK3.IN3 R9.2
N$27
  Top 0.254: D11.C R9.1
  Bottom 0.254: D11.C 27.37,22.86 7.37,42.86 7.37,93.09 8.7,94.42 30.93,94.42 38.04,87.31 38.04,81.76 47.37,72.42 53.15,72.42 PRJ1.8
N$28  (via drill 0.64)
  Top 0.254: R8.1 36.04,20.41 33.81,20.41 D12.C 33.59,20.41 32.04,21.97 32.04,23.53 40.48,31.97 v40.48,33.75 | v40.48,41.53 47.15,48.2 47.15,63.31 53.15,69.31 53.15,69.75 PRJ1.9/CS
  Bottom 0.254: v40.48,33.75 v40.48,41.53
N$29  (via drill 0.64)
  Top 0.254: R7.1 36.04,17.75 33.81,17.75 D13.C 33.59,17.97 31.15,20.41 31.15,23.97 38.04,30.86 v38.04,31.53 | v44.7,40.86 44.7,44.42 48.04,47.75 48.04,61.75 53.15,66.87 53.15,67.31 PRJ1.10/CS
  Bottom 0.254: v44.7,40.86 44.7,35.97 40.26,31.53 v38.04,31.53
N$30
  Top 0.254: Q1.2 57.15,22.86 R10.1
N$31
  Top 0.254: 61.15,27.08 69.15,27.08 71.15,29.08 REL1.1 | 61.15,27.08 59.15,27.08 56.93,24.86 53.37,24.86 Q1.3 | 61.15,27.08 61.15,24.64 51.82,15.3 50.93,15.3 D2.C
N$32
  Top 1: IC1.IN 82.49,7.75 78.93,7.75 75.82,10.86 70.04,10.86 C2.+ 69.37,10.86 62.93,10.86 | 62.93,10.86 62.93,9.3 63.15,9.08 POWER_IN.2 | 62.93,10.86 62.93,15.08 D3.C 62.93,15.75 62.93,15.97 67.15,20.19 D1.A
N$39
  Bottom 1: REL1.4 53.37,29.08 53.37,27.3 55.15,25.53 55.15,23.3 52.26,20.41 D1.C
N$40
  Top 0.254: PRJ1.39/A20 73.6,57.09 73.6,85.76 74.71,86.87 77.6,86.87 81.38,83.09 81.38,44.42 84.93,40.86 84.93,31.75 S1.4
N$41
  Top 0.254: R15.2 50.93,12.64 53.37,10.19 LED1.A
N$42  (via drill 0.64)
  Top 0.254: v46.48,38.64 51.59,33.53 69.6,33.53 72.71,30.42 72.71,27.97 70.26,25.53 67.37,25.53 R10.2 | v41.59,59.09 41.59,68.87 v51.37,78.64
  Bottom 0.254: v46.48,38.64 46.48,42.86 41.59,47.75 v41.59,59.09 | v51.37,78.64 51.37,90.87 53.15,92.65 PRJ1.0/RX
N$43
  Top 0.254: R12.2 43.37,86.42 43.37,87.76 45.59,89.98 DRK1.EN
N$44
  Top 0.254: PRJ1.29 53.37,44.42 58.71,44.42 67.82,35.31 70.49,35.31 75.38,30.42 75.38,28.42 76.04,27.75 86.49,27.75 88.49,29.75 88.49,35.08 89.38,35.97 90.93,35.97 91.82,35.08 91.82,25.75 90.27,24.19 U$1.IN1
N$45
  Bottom 0.254: U$1.EN 83.38,4.63 73.37,4.63 67.15,10.86 58.48,10.86 57.82,10.19 57.82,9.97 56.48,8.64 52.71,8.64 48.93,12.41 48.93,34.64 53.15,38.86 53.15,39.31 PRJ1.31/A12
N$46  (via drill 0.64)
  Top 0.254: R12.1 35.37,86.42 33.81,86.42 D4.C | v34.48,65.31 34.48,64.64 35.37,63.75 35.37,55.98 R13.1
  Bottom 0.254: PRJ1.24 53.15,57.31 51.82,57.31 48.7,60.42 37.81,60.42 35.37,57.98 35.37,55.98 R13.1 35.59,55.75 37.15,54.2 37.15,47.75 34.48,45.09 34.48,28.42 36.04,26.86 36.04,25.53 R14.1 | v34.48,65.31 34.48,73.53 32.04,75.98 32.04,84.64 33.59,86.2 D4.C
N$47
  Top 0.254: PRJ1.30 53.37,41.75 60.04,41.75 67.37,34.42 70.04,34.42 74.49,29.97 74.49,27.97 75.6,26.86 90.04,26.86 U$1.IN2
N$48
  Top 0.254: R13.2 43.37,55.98 45.82,58.42 DRK2.EN
N$52
  Bottom 0.254: PRJ1.RESET 66.04,28.86 70.71,24.19 76.49,24.19 78.04,22.64 S2.3
N$60  (via drill 0.64)
  Top 0.254: v94.04,15.97 92.27,15.97 90.27,13.97 U$1.FB
  Bottom 0.254: v94.04,15.97 117.16,39.08 117.16,91.76 112.05,96.87 68.04,96.87 64.48,93.31 64.48,61.31 68.49,57.31 PRJ1.A22/DAC1
RED-M1
  Top 1: DC-MOTOR.1 113.16,91.31 114.27,91.31 117.6,87.98 117.6,18.19 111.38,11.97 U$1.OUT1
RST  (via drill 0.64)
  Top 0.254: v107.82,47.97 112.49,43.31 112.94,43.31 CONTROL.7 | v107.82,71.31 107.82,77.09 104.93,79.98 104.27,79.98 U$3.13
  Bottom 0.254: v107.82,71.31 v107.82,47.97
RX5
  Bottom 0.254: PRJ1.34/A15 68.71,39.31 100.49,39.31 101.82,37.97 113.38,37.97 115.38,39.97 115.38,46.42 113.6,48.2 113.16,48.2 CONTROL.5
SCL1
  Top 0.254: PRJ1.38/A19 72.93,49.53 75.38,51.98 76.04,51.98 U$3.29
SDA1
  Bottom 0.254: PRJ1.37/A18 68.71,47.09 68.71,47.53 73.6,52.42 73.6,52.64 75.38,54.42 76.04,54.42 U$3.28
TX5
  Top 0.254: PRJ1.33/A14 68.71,36.86 68.71,37.31 78.71,47.31 78.71,75.53 76.93,77.31 76.26,77.31 U$3.19
  Bottom 0.254: CONTROL.4 113.16,50.64 113.6,50.64 116.27,47.97 116.27,39.53 113.6,36.86 68.71,36.86 PRJ1.33/A14
WH_ENC_B  (via drill 0.64)
  Top 0.254: v86.04,43.09 86.04,58.42 99.82,72.2 99.82,83.98 102.71,86.87 105.6,86.87 109.82,82.64 v109.82,75.98
  Bottom 0.254: v86.04,43.09 84.93,41.97 68.71,41.97 PRJ1.35/A16 | v109.82,75.98 110.27,75.98 DC-MOTOR.6
Y_ENC_A  (via drill 0.64)
  Top 0.254: v110.71,39.31 111.38,39.31 111.6,39.08 114.49,39.08 116.27,40.86 116.27,78.42 113.6,81.09 113.16,81.09 DC-MOTOR.5
  Bottom 0.254: v110.71,39.31 101.82,39.31 96.71,44.42 68.71,44.42 PRJ1.36/A17

### Text on the board
tNames: B | A | VDD | GND | M2 | M1 | INT | GND | A | VDD | B | SDA | SCL | 3.3V | GND | GND | 3.3V | 5.0V | TX5 | RX5 | A0 | RST | GND | A | VDD | B | D0 | A | GND | A | VDD | B | MOTOR / GND | MOTOR / 12-24V